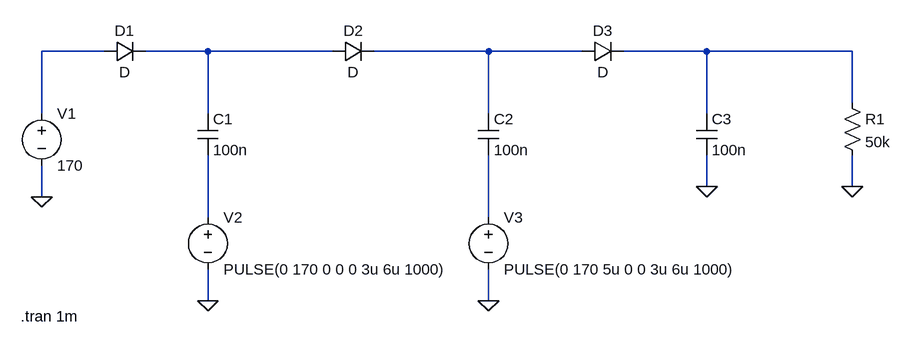
[diagram p0: schematic Doubler.asc]
Doubler.asc, the LTspice schematic file:
Version 4
SHEET 1 1316 680
WIRE 96 -16 0 -16
WIRE 256 -16 160 -16
WIRE 448 -16 256 -16
WIRE 688 -16 512 -16
WIRE 832 -16 688 -16
WIRE 1024 -16 896 -16
WIRE 1248 -16 1024 -16
WIRE 1248 64 1248 -16
WIRE 0 80 0 -16
WIRE 256 80 256 -16
WIRE 688 80 688 -16
WIRE 1024 80 1024 -16
WIRE 1024 192 1024 144
WIRE 1248 192 1248 144
WIRE 0 208 0 160
WIRE 256 240 256 144
WIRE 688 240 688 144
WIRE 256 368 256 320
WIRE 688 368 688 320
FLAG 0 208 0
FLAG 256 368 0
FLAG 688 368 0
FLAG 1024 192 0
FLAG 1248 192 0
SYMBOL voltage 0 64 R0
WINDOW 123 0 0 Left 0
WINDOW 39 0 0 Left 0
SYMATTR InstName V1
SYMATTR Value 170
SYMBOL voltage 256 224 R0
WINDOW 123 0 0 Left 0
WINDOW 39 0 0 Left 0
SYMATTR InstName V2
SYMATTR Value PULSE(0 170 0 0 0 3u 6u 1000)
SYMBOL voltage 688 224 R0
WINDOW 123 0 0 Left 0
WINDOW 39 0 0 Left 0
SYMATTR InstName V3
SYMATTR Value PULSE(0 170 5u 0 0 3u 6u 1000)
SYMBOL diode 96 0 R270
WINDOW 0 32 32 VTop 2
WINDOW 3 0 32 VBottom 2
SYMATTR InstName D1
SYMBOL diode 448 0 R270
WINDOW 0 32 32 VTop 2
WINDOW 3 0 32 VBottom 2
SYMATTR InstName D2
SYMBOL cap 240 80 R0
SYMATTR InstName C1
SYMATTR Value 100n
SYMBOL cap 672 80 R0
SYMATTR InstName C2
SYMATTR Value 100n
SYMBOL cap 1008 80 R0
SYMATTR InstName C3
SYMATTR Value 100n
SYMBOL diode 832 0 R270
WINDOW 0 32 32 VTop 2
WINDOW 3 0 32 VBottom 2
SYMATTR InstName D3
SYMBOL res 1232 48 R0
SYMATTR InstName R1
SYMATTR Value 50k
TEXT -32 392 Left 2 !.tran 1m

The netlist it stands for:
* Doubler.asc
V1 N001 0 170
V2 N005 0 PULSE(0 170 0 0 0 3u 6u 1000)
V3 N006 0 PULSE(0 170 5u 0 0 3u 6u 1000)
D1 N001 N002 D
D2 N002 N003 D
C1 N002 N005 100n
C2 N003 N006 100n
C3 N004 0 100n
D3 N003 N004 D
R1 N004 0 50k
.model D D
.lib standard.dio
.tran 1m
.backanno
.end